# EAGLE schematic you-are-now (EAGLE 9.1.0)
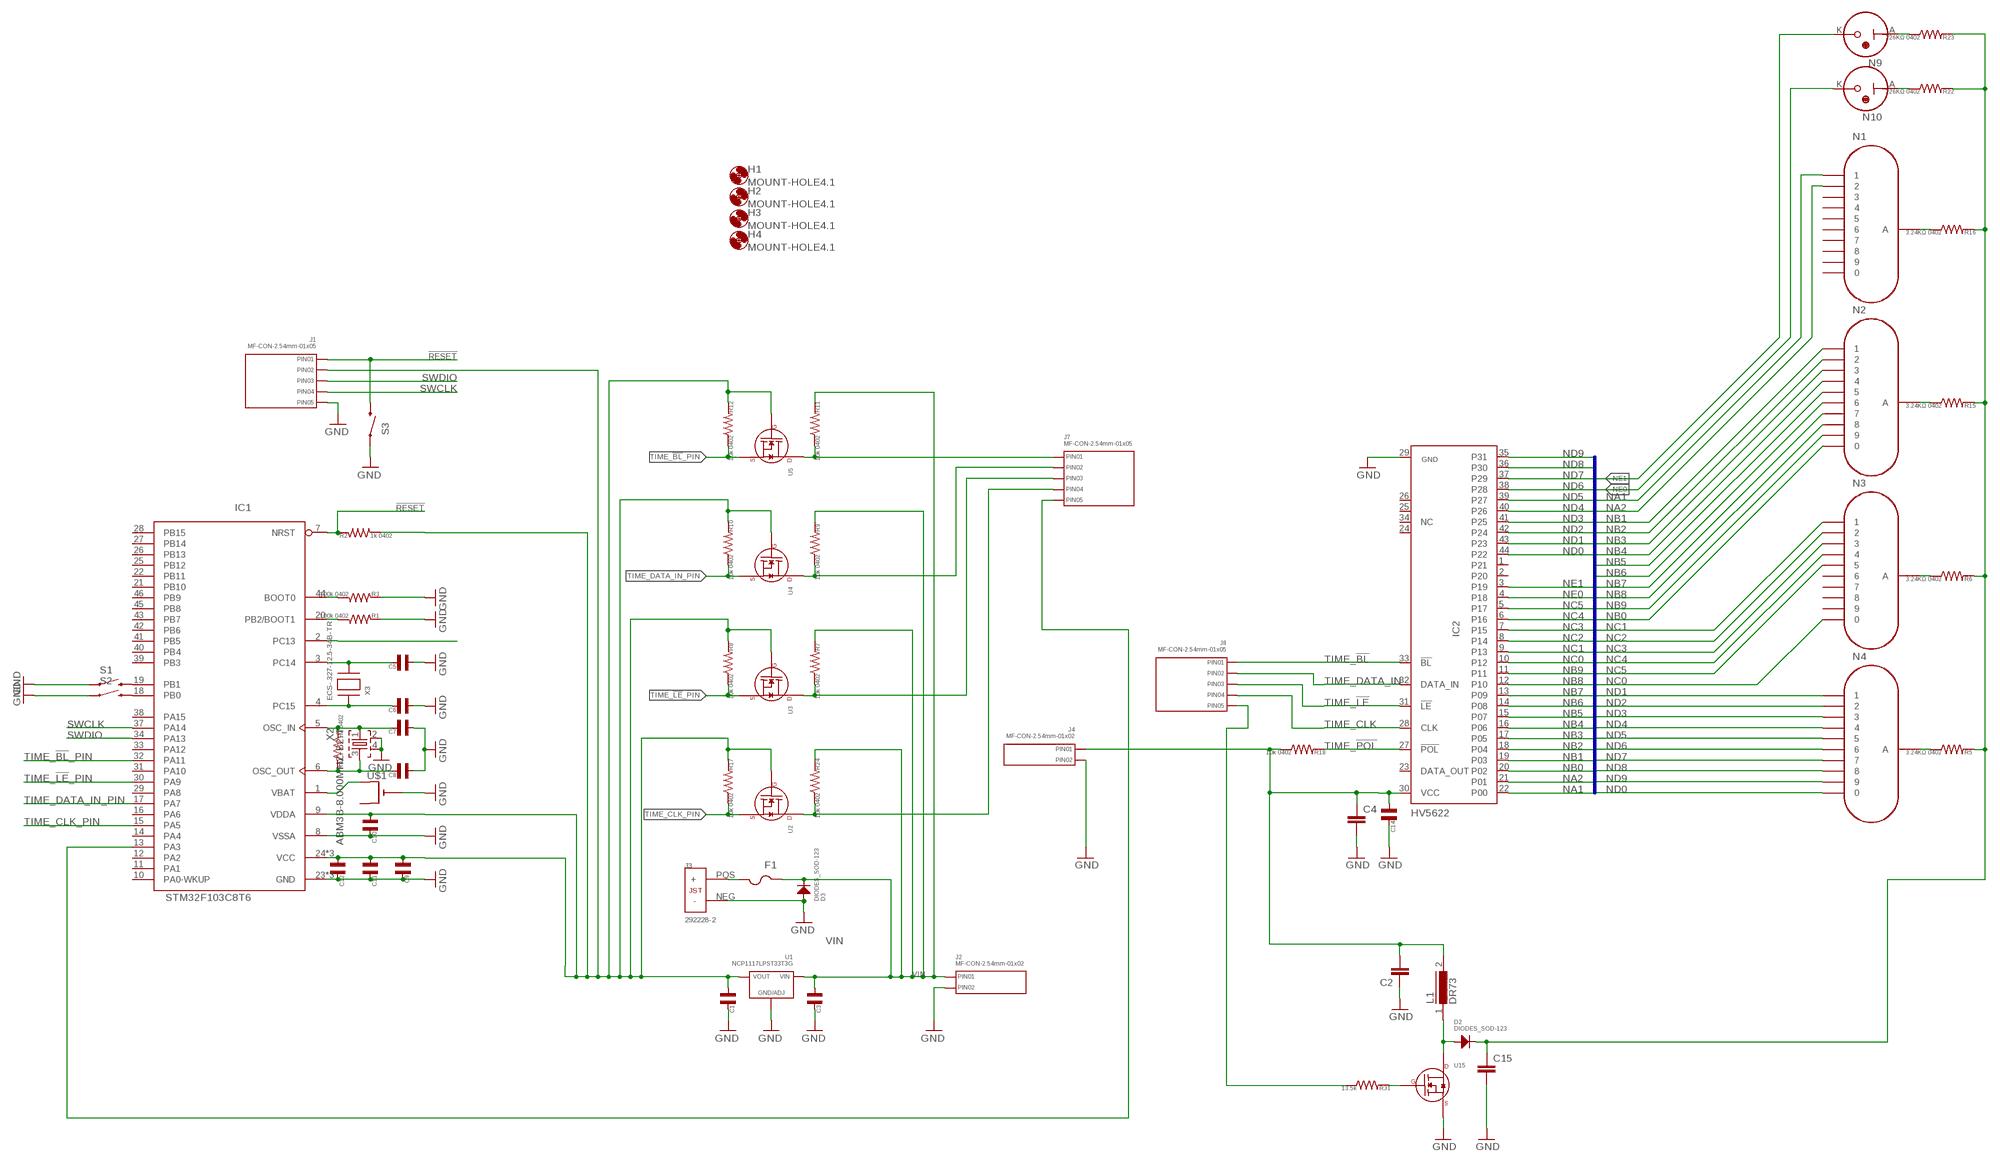
[diagram p0: schematic, sheet 1]

## Parts
C1  CAPACITOR_NP_1206  [C1206]
C2  C-EUC1812  [C1812]
C3  CAPACITOR_NP_1206  [C1206]
C4  C-EUC1812  [C1812]
C5  CAPACITOR_NP_0402  [C0402]
C6  CAPACITOR_NP_0402  [C0402]
C7  CAPACITOR_NP_0402  [C0402]
C8  CAPACITOR_NP_0402  [C0402]
C9  CAPACITOR_NP_0402  [C0402]
C10  CAPACITOR_NP_0402  [C0402]
C11  CAPACITOR_NP_0402  [C0402]
C12  CAPACITOR_NP_0402  [C0402]
C14  CAPACITOR_NP_0402  [C0402]
C15  C-EUC1812  [C1812]
D2  DIODES_SOD-123  [SOD-123]
D3  DIODES_SOD-123  [SOD-123]
F1  PTCFUSE-1812  [1812]
H1  MOUNT-HOLE4.1  [4,1]
H2  MOUNT-HOLE4.1  [4,1]
H3  MOUNT-HOLE4.1  [4,1]
H4  MOUNT-HOLE4.1  [4,1]
IC1  STM32F103C8T6  STM32F103C8T  [LQFP48]
IC2  HV5622  [QFP44]
J1  MF-CON-2.54mm-01x05  CON_01X05_PTH_2.54MM  [PTH_2.54MM_01X05]
J2  MF-CON-2.54mm-01x02  CON_01X02_PTH_2.54MM  [PTH_2.54MM_01X02]
J3  292228-2  MINICT  [292228-2]
J4  MF-CON-2.54mm-01x02  CON_01X02_PTH_2.54MM  [PTH_2.54MM_01X02]
J7  MF-CON-2.54mm-01x05  CON_01X05_PTH_2.54MM  [PTH_2.54MM_01X05]
J8  MF-CON-2.54mm-01x05  CON_01X05_PTH_2.54MM  [PTH_2.54MM_01X05]
L1  DR73  [DR73]
N1  Hour1  IN-12A  [IN-12]
N2  Hour2  IN-12A  [IN-12]
N3  Minutes1  IN-12A  [IN-12]
N4  Minutes2  IN-12A  [IN-12]
N9  RainyBulb  INS-1  [INS-1]
N10  SnowyBulb  INS-1  [INS-1]
R1  100k 0402  RESISTOR_0402  [R0402]
R2  1k 0402  RESISTOR_0402  [R0402]
R3  100k 0402  RESISTOR_0402  [R0402]
R4  1M 0402  RESISTOR_0402  [R0402]
R5  3.24KΩ 0402  RESISTOR_0402  [R0402]
R6  3.24KΩ 0402  RESISTOR_0402  [R0402]
R7  10k 0402  RESISTOR_0402  [R0402]
R8  10k 0402  RESISTOR_0402  [R0402]
R9  10k 0402  RESISTOR_0402  [R0402]
R10  10k 0402  RESISTOR_0402  [R0402]
R11  10k 0402  RESISTOR_0402  [R0402]
R12  10k 0402  RESISTOR_0402  [R0402]
R15  3.24KΩ 0402  RESISTOR_0402  [R0402]
R16  3.24KΩ 0402  RESISTOR_0402  [R0402]
R17  10k 0402  RESISTOR_0402  [R0402]
R18  10k 0402  RESISTOR_0402  [R0402]
R22  226KΩ 0402  RESISTOR_0402  [R0402]
R23  226KΩ 0402  RESISTOR_0402  [R0402]
R24  10k 0402  RESISTOR_0402  [R0402]
R31  13.5k  RESISTOR_0402  [R0402]
S1  SWITCH-MOMENTARY-2TACTILE-SWITCH-SMD-RIGHT-ANGLE  [TACTILE_SWITCH-SMD-RIGHT-ANGLE]
S2  SWITCH-MOMENTARY-2TACTILE-SWITCH-SMD-RIGHT-ANGLE  [TACTILE_SWITCH-SMD-RIGHT-ANGLE]
S3  SWITCH-MOMENTARY-2TACTILE-SWITCH-SMD-RIGHT-ANGLE  [TACTILE_SWITCH-SMD-RIGHT-ANGLE]
U1  NCP1117LPST33T3G  [SOT-223-3]
U2  N-CHANNEL_FET_SOT-23-3  [SOT-23-3]
U3  N-CHANNEL_FET_SOT-23-3  [SOT-23-3]
U4  N-CHANNEL_FET_SOT-23-3  [SOT-23-3]
U5  N-CHANNEL_FET_SOT-23-3  [SOT-23-3]
U15  N-CHANNEL_FET_TO-252-3  [TO-252-3]
U$1  CR1220SMT  [CR1220-SMD]
X2  ABM3B-8.000MHZ-B2-T  CRYSTALS-GND-LID-CFPX-104  [5.2X3.4-4-PAD]
X3  ECS-.327-12.5-34B-TR  XTAL-3.2X1.5  [XTAL3215]

## Nets
!RESET: IC1.7(NRST) J1.P$1(PIN1) R2.P$2 S3.2
GND [Power]: C1.P$2 C2.1 C3.P$2 C4.2 C5.P$1 C6.P$1 C7.P$1 C8.P$1 C9.P$2 C10.P$2 C11.P$2 C12.P$2 C14.P$2 C15.2 D3.ANODE IC1.8(VSSA) IC1.23(GND) IC1.35(GND) IC1.47(GND) IC2.29(GND) J1.P$5(PIN5) J2.P$2(PIN2) J3.NEG(-) J4.P$2(PIN2) R1.P$2 R3.P$2 S1.1 S2.1 S3.1 U1.P$2(GND/ADJ) U15.2(SOURCE) U$1.- X2.2 X2.4
HV9 [Power]: C15.1 D2.CATHODE R5.P$2 R6.P$2 R15.P$2 R16.P$2 R22.P$2 R23.P$2
HV_PWM: IC1.13(PA3) J7.P$5(PIN5)
N$1: IC1.19(PB1) S1.2
N$2: N9.A R23.P$1
N$3: N10.A R22.P$1
N$4: N1.A R16.P$1
N$5: N2.A R15.P$1
N$6: N3.A R6.P$1
N$7: N4.A R5.P$1
N$8: C1.P$1 C9.P$1 C10.P$1 C11.P$1 C12.P$1 IC1.9(VDDA) IC1.24(VCC) IC1.36(VCC) IC1.48(VCC) J1.P$2(PIN2) R2.P$1 R8.P$2 R10.P$2 R12.P$2 R17.P$2 U1.P$1(VOUT) U1.P$3(VOUT) U2.P$1(GATE) U3.P$1(GATE) U4.P$1(GATE) U5.P$1(GATE)
N$9: IC1.18(PB0) S2.2
N$10 [thicc]: C2.2 C4.1 C14.P$1 IC2.30(VCC) J4.P$1(PIN1) L1.2 R18.P$1
N$11: J8.P$5(PIN5) R31.P$1
N$31: IC1.20(PB2/BOOT1) R1.P$1
N$32: IC1.44(BOOT0) R3.P$1
N$36: C5.P$2 IC1.3(PC14) X3.P$2
N$37: C6.P$2 IC1.4(PC15) X3.P$1
N$38: C7.P$2 IC1.5(OSC_IN) R4.P$1 X2.1
N$39: C8.P$2 IC1.6(OSC_OUT) R4.P$2 X2.3
N$41: D2.ANODE L1.1 U15.PAD(DRAIN)
N$43: IC1.1(VBAT) U$1.+$1(+)
N$66: R31.P$2 U15.1(GATE)
N$69: F1.2 J3.POS(+)
NA1: IC2.22(P00) N1.1
NA2: IC2.21(P01) N1.2
NB0: IC2.20(P02) N2.0
NB1: IC2.19(P03) N2.1
NB2: IC2.18(P04) N2.2
NB3: IC2.17(P05) N2.3
NB4: IC2.16(P06) N2.4
NB5: IC2.15(P07) N2.5
NB6: IC2.14(P08) N2.6
NB7: IC2.13(P09) N2.7
NB8: IC2.12(P10) N2.8
NB9: IC2.11 N2.9
NC0: IC2.10(P12) N3.0
NC1: IC2.9(P13) N3.1
NC2: IC2.8(P14) N3.2
NC3: IC2.7(P15) N3.3
NC4: IC2.6(P16) N3.4
NC5: IC2.5(P17) N3.5
ND0: IC2.44(P22) N4.0
ND1: IC2.43(P23) N4.1
ND2: IC2.42(P24) N4.2
ND3: IC2.41(P25) N4.3
ND4: IC2.40(P26) N4.4
ND5: IC2.39(P27) N4.5
ND6: IC2.38(P28) N4.6
ND7: IC2.37(P29) N4.7
ND8: IC2.36(P30) N4.8
ND9: IC2.35(P31) N4.9
NE0: IC2.4(P18) N10.K
NE1: IC2.3(P19) N9.K
PC13: IC1.2(PC13)
SWCLK: IC1.37(PA14) J1.P$4(PIN4)
SWDIO: IC1.34(PA13) J1.P$3(PIN3)
TIME_!BL: IC2.33(!BL) J7.P$1(PIN1) J8.P$1(PIN1) R11.P$1 U5.P$3(DRAIN)
TIME_!BL!_PIN: IC1.32(PA11) R12.P$1 U5.P$2(SOURCE)
TIME_!LE: IC2.31(!LE!) J7.P$3(PIN3) J8.P$3(PIN3) R7.P$1 U3.P$3(DRAIN)
TIME_!LE!_PIN: IC1.30(PA9) R8.P$1 U3.P$2(SOURCE)
TIME_!POL: IC2.27(!POL!) R18.P$2
TIME_CLK: IC2.28(CLK) J7.P$4(PIN4) J8.P$4(PIN4) R24.P$1 U2.P$3(DRAIN)
TIME_CLK_PIN: IC1.15(PA5) R17.P$1 U2.P$2(SOURCE)
TIME_DATA_IN: IC2.32(DATA_IN) J7.P$2(PIN2) J8.P$2(PIN2) R9.P$1 U4.P$3(DRAIN)
TIME_DATA_IN_PIN: IC1.17(PA7) R10.P$1 U4.P$2(SOURCE)
VIN [thicc]: C3.P$1 D3.CATHODE F1.1 J2.P$1(PIN1) R7.P$2 R9.P$2 R11.P$2 R24.P$2 U1.P$4(VIN)
Unconnected: IC1.10(PA0-WKUP) IC1.11(PA1) IC1.12(PA2) IC1.14(PA4) IC1.16(PA6) IC1.21(PB10) IC1.22(PB11) IC1.25(PB12) IC1.26(PB13) IC1.27(PB14) IC1.28(PB15) IC1.29(PA8) IC1.31(PA10) IC1.33(PA12) IC1.38(PA15) IC1.39(PB3) IC1.40(PB4) IC1.41(PB5) IC1.42(PB6) IC1.43(PB7) IC1.45(PB8) IC1.46(PB9) IC2.1(P21) IC2.2(P20) IC2.23(DATA_OUT) IC2.24(NC) IC2.25(NC) IC2.26(NC) IC2.34(NC) N1.0 N1.3 N1.4 N1.5 N1.6 N1.7 N1.8 N1.9 N3.6 N3.7 N3.8 N3.9 U$1.+$2(+1)

## Buses
NA[1..2],NB[0..9],NC[0..5],ND[0..9],NE[0..1]

## Library data of the parts
C1 C3 C5-C12 C14 = MF_Passives:CAPACITOR_NP: Library: MF_Passives Description: Device for Non-Polarized Capacitors. Manufacture part number (MPN) can be added via Attributes. Check https://factory.macrofab.com/parts for the house parts list.; POPULATE: 1
C2 C4 C15 = resistor:C-EU: CAPACITOR, European symbol
D2 D3 = MF_Discrete_Semiconductor:DIODES: Library: MF_Discrete_Semiconductor Description: Device for Single Packaged Diodes.; HOUSEPART: NO; POPULATE: 1
F1 = adafruit:PTCFUSE: PTC fuses, resettable thermistors
H1-H4 = holes:MOUNT-HOLE: MOUNTING HOLE with drill center marker
IC1 = micro-stm_v2:STM32F103C*T: ARM 32-bit Cortex™-M3 CPU 72 MHz maximum frequency 16 to 128 Kbytes of Flash memory 6 to 20 kbytes of SRAM 37 GPIOs 2.0 to 3.6 V application supply
IC2 = nixie_tube:HV5622
J1 J7 J8 = MF_Connectors:CON_01X05: Library: MF_Connectors Description: Header Connector with 5 Positions and 01 Rows. Use the LABEL Attribute to label the pin on the schematic and PCB. You can remove the attributes on the PCB by using the SMASH function on the part and then deleting the text.; HOUSEPART: YES; MPN: MF-CON-2.54mm-01x05; POPULATE: 1; URL: https://factory.macrofab.com/part/MF-CON-2.54mm-01x05
J2 J4 = MF_Connectors:CON_01X02: Library: MF_Connectors Description: Header Connector with 02 Positions and 01 Rows. Use the LABEL Attribute to label the pin on the schematic and PCB. You can remove the attributes on the PCB by using the SMASH function on the part and then deleting the text.; HOUSEPART: YES; MPN: MF-CON-2.54mm-01x02; POPULATE: 1; URL: https://factory.macrofab.com/part/MF-CON-2.54mm-01x02
J3 = sonik:MINICT
L1 = inductors:DR73: High Power Density, High Efficiency, Shielded Inductors Source: coiltronics_dr_series.pdf; SPICEPREFIX: L
N1-N4 = russian-nixies:IN-12A: IN-12A: medium numeric topview nixie tube
N9 N10 = russian-nixies:INS-1
R1-R12 R15-R18 R22-R24 R31 = MF_Passives:RESISTOR: Library: MF_Passives Description: Device for Resistors. Manufacture part number (MPN), Voltage, Tolerance, and Wattage Rating can be added via Attributes. Check https://factory.macrofab.com/parts for the house parts list.; POPULATE: 1
S1-S3 = sonik:SWITCH-MOMENTARY-2: Various NO switches- pushbuttons, reed, etc; PROD_ID: COMP-12265
U1 = MF_IC_Power:NCP1117LP: Manufacturer Part #: NCP1117LP Manufacturer: ON Semiconductor Description: LDO Voltage Regulators; HOUSEPART: NO; MPN: NCP1117LPST33T3G; POPULATE: 1; URL: http://www.onsemi.com/pub_link/Collateral/NCP1117LP-D.PDF
U2-U5 U15 = MF_Discrete_Semiconductor:N-CHANNEL_FET: Library: MF_Discrete_Semiconductor Description: Device for Single N-Channel Mosfet. Manufacture part number (MFG#) can be added via Attributes.; HOUSEPART: NO; POPULATE: 1
U$1 = adafruit:CR1220: CR1216/CR1220/CR1225 12mm 3V lithium coin cell Great for battery packup. Both SMT and THM holders. Note the THM package has the ground pads on both sides of the PCB so that the masks are the same - this reduces the cost
X2 = IQD-Frequency-Products:CRYSTALS-GND-LID: CRYSTALS WITH CAN GROUNDED
X3 = adafruit:XTAL: Low cost SMT crystals, no capacitors included http://www.ladyada.net/library/eagle

## Net classes
1 Power: width 0.305 mm
2 thicc: width 0.61 mm